# Altium schematic sheet [4]-MECH_BUTTONS.SchDoc: [4]-MECH_BUTTONS
size A3; DocumentNumber: 4; Revision: 01-01-2020; SheetNumber: 4; SheetTotal: 6
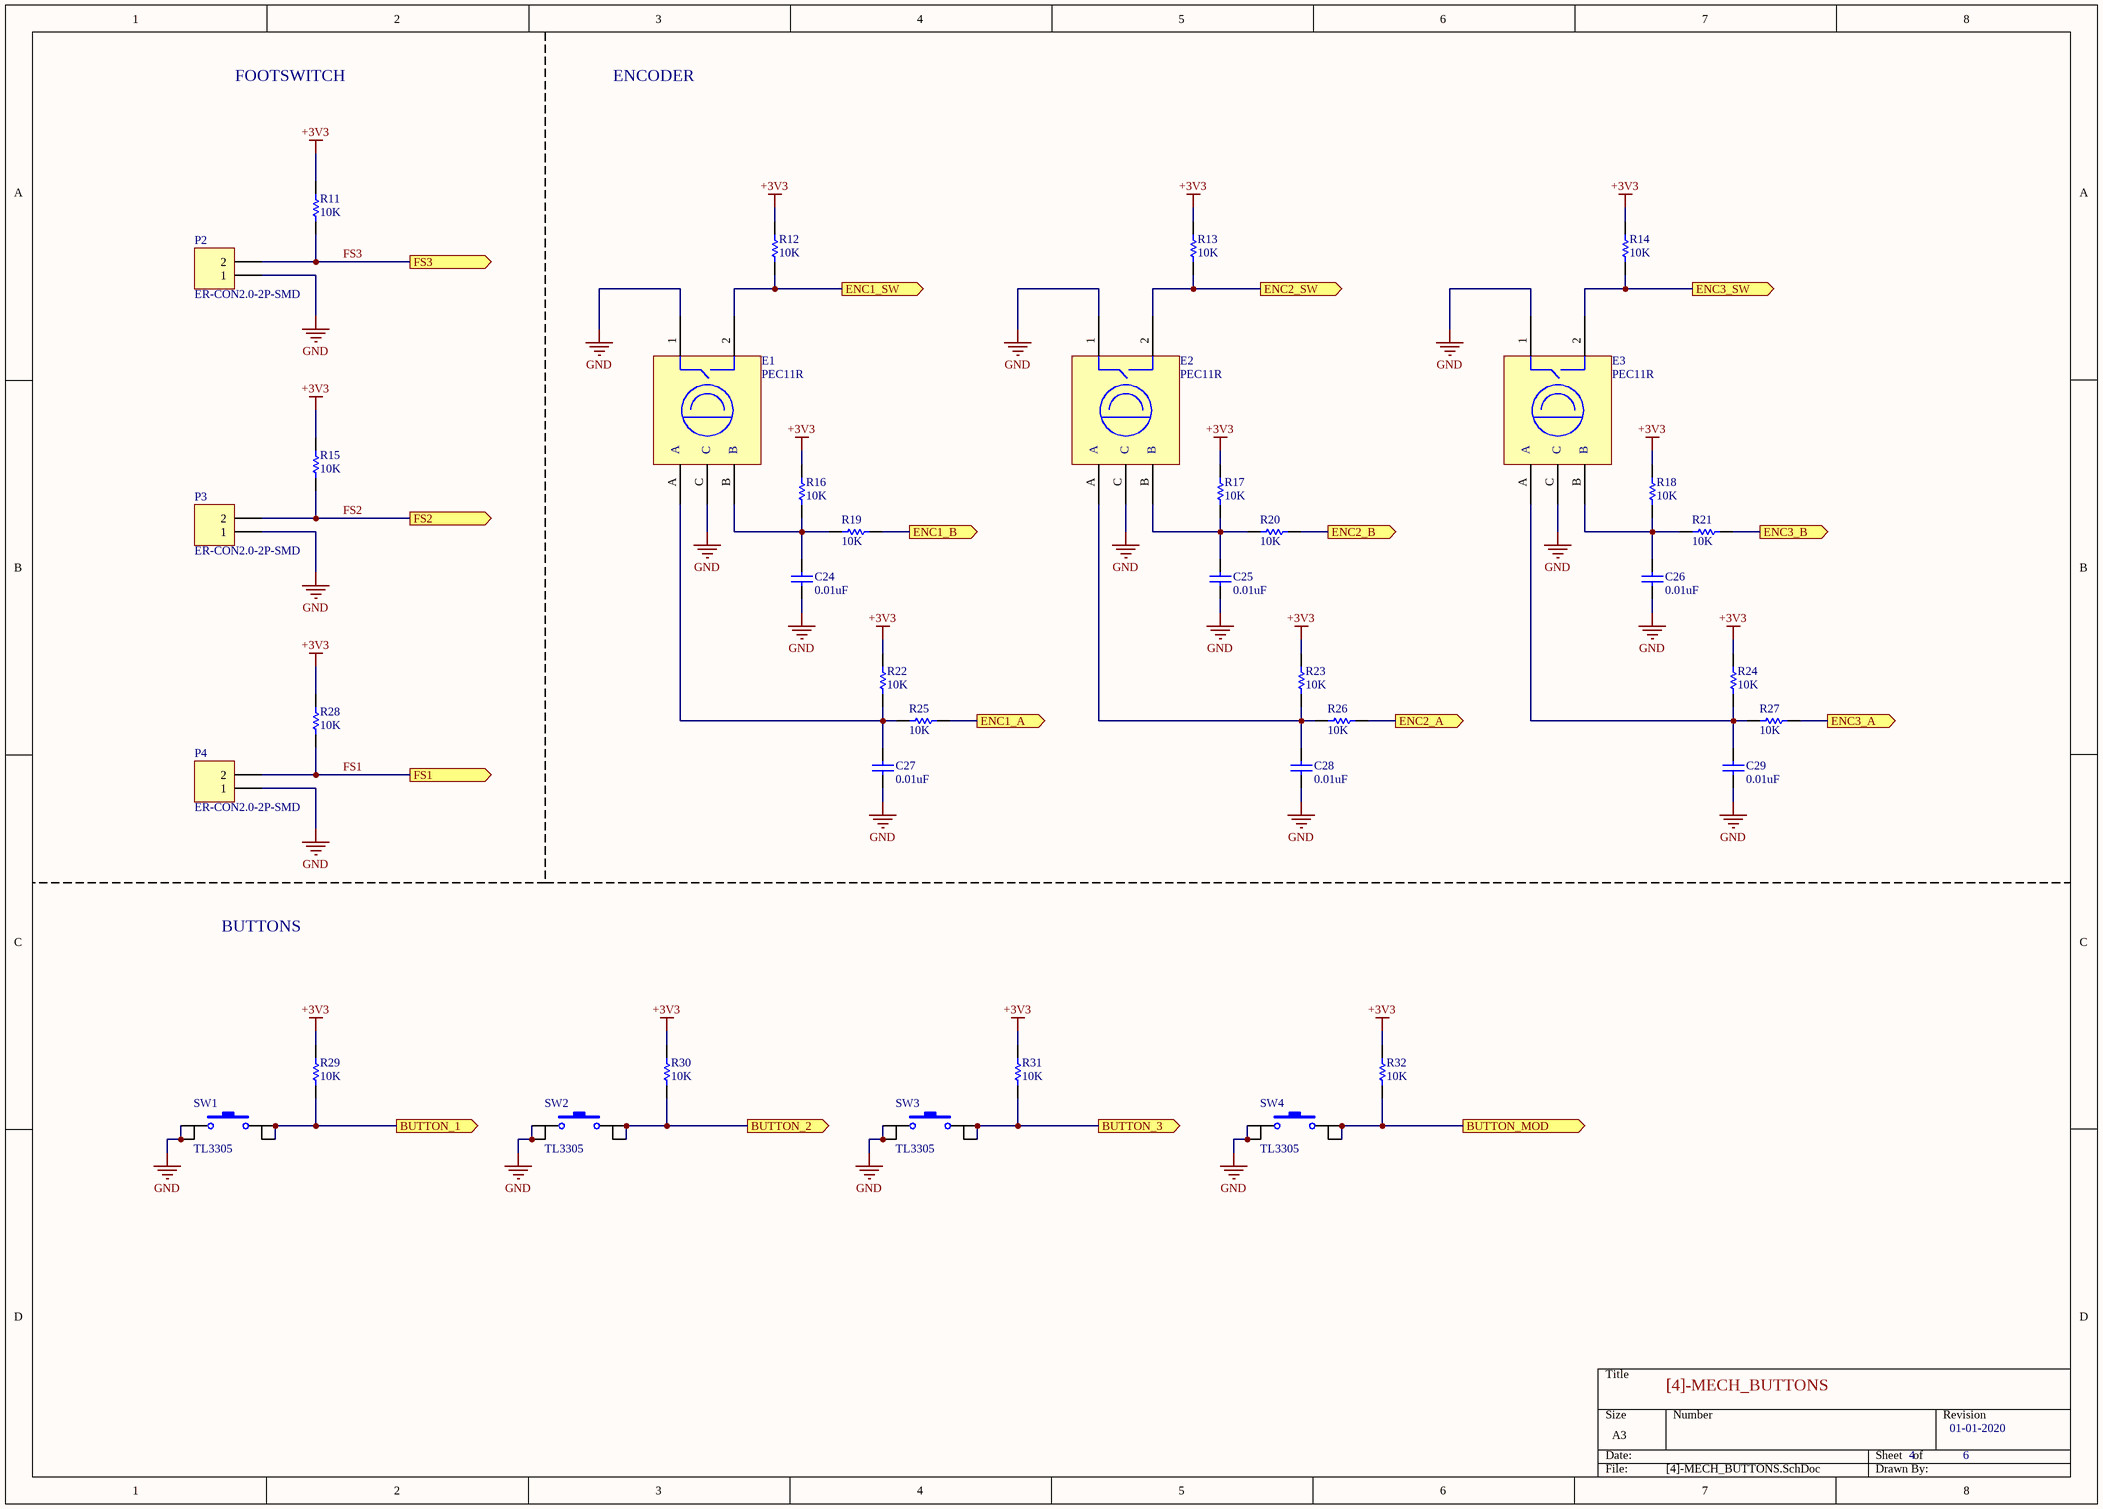
[diagram p0: [4]-MECH_BUTTONS.SchDoc]

## Parts
C24  0.01uF  [CAPC1608N]
C25  0.01uF  [CAPC1608N]
C26  0.01uF  [CAPC1608N]
C27  0.01uF  [CAPC1608N]
C28  0.01uF  [CAPC1608N]
C29  0.01uF  [CAPC1608N]
E1  PEC11R  [PEC11R]
E2  PEC11R  [PEC11R]
E3  PEC11R  [PEC11R]
P2  ER-CON2.0-2P-SMD  [ER-CON2.0-2P-SMD]
P3  ER-CON2.0-2P-SMD  [ER-CON2.0-2P-SMD]
P4  ER-CON2.0-2P-SMD  [ER-CON2.0-2P-SMD]
R11  10K  [RESC1608N]
R12  10K  [RESC1608N]
R13  10K  [RESC1608N]
R14  10K  [RESC1608N]
R15  10K  [RESC1608N]
R16  10K  [RESC1608N]
R17  10K  [RESC1608N]
R18  10K  [RESC1608N]
R19  10K  [RESC1608N]
R20  10K  [RESC1608N]
R21  10K  [RESC1608N]
R22  10K  [RESC1608N]
R23  10K  [RESC1608N]
R24  10K  [RESC1608N]
R25  10K  [RESC1608N]
R26  10K  [RESC1608N]
R27  10K  [RESC1608N]
R28  10K  [RESC1608N]
R29  10K  [RESC1608N]
R30  10K  [RESC1608N]
R31  10K  [RESC1608N]
R32  10K  [RESC1608N]
SW1  TL3305  [TL3305]
SW2  TL3305  [TL3305]
SW3  TL3305  [TL3305]
SW4  TL3305  [TL3305]

## Ports
BUTTON_1 (out), BUTTON_2 (out), BUTTON_3 (out), BUTTON_MOD (out), ENC1_A (out), ENC1_B (out), ENC1_SW (out), ENC2_A (out), ENC2_B (out), ENC2_SW (out), ENC3_A (out), ENC3_B (out), ENC3_SW (out), FS1 (out), FS2 (out), FS3 (out)

## Nets
+3V3: R11.1 R12.2 R13.2 R14.2 R15.1 R16.2 R17.2 R18.2 R22.2 R23.2 R24.2 R28.1 R29.2 R30.2 R31.2 R32.2
GND: C24.1 C25.1 C26.1 C27.1 C28.1 C29.1 E1.1 E1.C E2.1 E2.C E3.1 E3.C P2.1 P3.1 P4.1 SW1.1 SW1.2 SW2.1 SW2.2 SW3.1 SW3.2 SW4.1 SW4.2
BUTTON_1: R29.1 SW1.3 SW1.4 ; port BUTTON_1
BUTTON_2: R30.1 SW2.3 SW2.4 ; port BUTTON_2
BUTTON_3: R31.1 SW3.3 SW3.4 ; port BUTTON_3
BUTTON_MOD: R32.1 SW4.3 SW4.4 ; port BUTTON_MOD
ENC1_A: R25.1 ; port ENC1_A
ENC1_B: R19.1 ; port ENC1_B
ENC1_SW: E1.2 R12.1 ; port ENC1_SW
ENC2_A: R26.1 ; port ENC2_A
ENC2_B: R20.1 ; port ENC2_B
ENC2_SW: E2.2 R13.1 ; port ENC2_SW
ENC3_A: R27.1 ; port ENC3_A
ENC3_B: R21.1 ; port ENC3_B
ENC3_SW: E3.2 R14.1 ; port ENC3_SW
FS1: P4.2 R28.2 ; port FS1
FS2: P3.2 R15.2 ; port FS2
FS3: P2.2 R11.2 ; port FS3
NetC24_2: C24.2 E1.B R16.1 R19.2
NetC25_2: C25.2 E2.B R17.1 R20.2
NetC26_2: C26.2 E3.B R18.1 R21.2
NetC27_2: C27.2 E1.A R22.1 R25.2
NetC28_2: C28.2 E2.A R23.1 R26.2
NetC29_2: C29.2 E3.A R24.1 R27.2

## Notes on the sheet
- FOOTSWITCH
- ENCODER
- BUTTONS

## Library data of the parts
C24-C29 = 06035C-103KAT2A: CAP CER 10000PF 50V X7R 0603; Manufacturer 1: Kyocera AVX; Dielectric Material: Ceramic; Tolerance: 10%; Capacitance: 10nF; Dissipation Factor: 2.5%; Insulation Resistance: 100GR; Supplier 1: Digi-Key; Manufacturer Part Number 1: 06035C-103KAT2A; Stock 1: 40000; Pricing 1: 1=0.1, 10=0.075, 100=0.0334, 500=0.02388, 1000=0.01877 (USD); Mount: Surface Mount,PCB; Case/Package: 0603; Number of Pins: 2; Case Code (Metric): 1608; Case Code (Imperial): 0603; Contact Plating: Tin,Matte; Min Operating Temperature: -55°C; Max Operating Temperature: 125°C; Dielectric: X7R; Voltage Rating (DC): 50V; Packaging: Tape and Reel; Voltage: 50V; Voltage Rating: 50V; Package Quantity: 1; Termination: SMD/SMT; Length: 1.6mm; Height: 0.9mm; Width: 0.032inch; Depth: 0.81mm; Thickness: 0.035inch; Radiation Hardening: No; REACH SVHC: No SVHC; Lead Free: Lead Free; ComponentLink1URL: https://datasheet.ciiva.com/1124/1679506-1124848.pdf; ComponentLink1Description: https://datasheet.ciiva.com/1124/1679506-1124848.pdf; ComponentLink2URL: https://datasheet.ciiva.com/2987/cx7r-2987824.pdf; ComponentLink2Description: https://datasheet.ciiva.com/2987/cx7r-2987824.pdf; ComponentLink3URL: https://datasheet.ciiva.com/150/cx7r-150227.pdf; ComponentLink3Description: https://datasheet.ciiva.com/150/cx7r-150227.pdf; ComponentLink4URL: https://datasheet.ciiva.com/150/cx7r-150228.pdf; ComponentLink4Description: https://datasheet.ciiva.com/150/cx7r-150228.pdf; ComponentLink5URL: https://datasheet.ciiva.com/150/cx7r-150229.pdf; ComponentLink5Description: https://datasheet.ciiva.com/150/cx7r-150229.pdf; ComponentLink6URL: https://datasheet.ciiva.com/16209/cx7r-16209238.pdf; ComponentLink6Description: https://datasheet.ciiva.com/16209/cx7r-16209238.pdf; ComponentLink7URL: https://datasheet.ciiva.com/15212/getdatasheetpartid-87506-15212295.pdf; ComponentLink7Description: https://datasheet.ciiva.com/15212/getdatasheetpartid-87506-15212295.pdf; ComponentLink8URL: https://datasheet.ciiva.com/5423/cx7r-218113-5423178.pdf; ComponentLink8Description: https://datasheet.ciiva.com/5423/cx7r-218113-5423178.pdf; ComponentLink9URL: https://datasheet.ciiva.com/7855/1679506-7855082.pdf; ComponentLink9Description: https://datasheet.ciiva.com/7855/1679506-7855082.pdf; ComponentLink10URL: https://datasheet.ciiva.com/14585/70001075-14585146.pdf; ComponentLink10Description: https://datasheet.ciiva.com/14585/70001075-14585146.pdf; ComponentLink11URL: https://datasheet.ciiva.com/25901/cx7r-25901100.pdf; ComponentLink11Description: https://datasheet.ciiva.com/25901/cx7r-25901100.pdf; ComponentLink12URL: https://datasheet.ciiva.com/1124/1679506-1124847.pdf; ComponentLink12Description: https://datasheet.ciiva.com/1124/1679506-1124847.pdf; ComponentLink13URL: https://datasheet.ciiva.com/2987/cx7r-2987823.pdf; ComponentLink13Description: https://datasheet.ciiva.com/2987/cx7r-2987823.pdf; Supplier Part Number 1: 478-1227-1-ND
E1-E3 = PEC11R-4215F-S0024: ENCODER ROTARY 15MM SHAFT; Manufacturer 1: Bourns; Number of Channels: 2; Encoder Type: Mechanical; Pulses per Revolution: 24; Detent: Yes; Output Type: Quadrature,Incremental; Hole Diameter: 1.8mm; Supplier 1: Digi-Key; Manufacturer Part Number 1: PEC11R-4215F-S0024; Stock 1: 2746; Pricing 1: 1=1.68, 10=1.566, 25=1.4792, 50=1.305, 150=1.073, 300=1.044, 600=0.986, 1050=0.928, 5100=0.812 (USD); Mount: Through Hole,Panel,PCB; Min Operating Temperature: -30°C; Max Operating Temperature: 70°C; Package Quantity: 150; Packaging: Bulk; Termination: PC Pins; Orientation: Vertical; Built in Switch: Yes; Type: Mechanical; Length: 21.5mm; Height: 13.4mm; Width: 12.5mm; Radiation Hardening: No; REACH SVHC: No SVHC; ComponentLink1URL: https://datasheet.ciiva.com/26917/getdatasheetpartid-730131-26917851.pdf; ComponentLink1Description: https://datasheet.ciiva.com/26917/getdatasheetpartid-730131-26917851.pdf; ComponentLink2URL: https://datasheet.ciiva.com/12175/pec11r-221203-12175422.pdf; ComponentLink2Description: https://datasheet.ciiva.com/12175/pec11r-221203-12175422.pdf; Supplier Part Number 1: PEC11R-4215F-S0024-ND
P2-P4 = ER-CON2.0-2P-SMD: CONN 2 POS SMD 2MM PITCH
R11-R32 = AC0603JR-0710KL: RES SMD 10K OHM 5% 1/10W 0603; Manufacturer 1: Yageo; Voltage Rating: 50V; Resistance: 10kR; Power Rating: 100mW; Temperature Coefficient: 100ppm/°C; Supplier 1: Digi-Key; Manufacturer Part Number 1: AC0603JR-0710KL; Stock 1: 60451; Pricing 1: 1=0.1, 10=0.032, 100=0.0131, 1000=0.00588, 2500=0.0051 (USD); Case/Package: 0603; Case Code (Imperial): 0603; Case Code (Metric): 1608; Min Operating Temperature: -55°C; Max Operating Temperature: 155°C; Packaging: Tape and Reel; Tolerance: 5%; Package Quantity: 1; Composition: Thick Film; Termination: SMD/SMT; Number of Terminations: 2; Military Standard: Not; Max Power Dissipation: 100mW; Features: Moisture Resistant,Automotive AEC-Q200,Anti-Sulfur; Length: 0.063inch; Height: 0.022inch; Width: 0.031inch; Depth: 0.8mm; Lead Free: Lead Free; ComponentLink1URL: https://datasheet.ciiva.com/5562/pyu-ac-51-rohs-l-2-5562553.pdf; ComponentLink1Description: https://datasheet.ciiva.com/5562/pyu-ac-51-rohs-l-2-5562553.pdf; Supplier Part Number 1: 311-10KLECT-ND
SW1-SW4 = TL3305AF160QG: SWITCH TACTILE SPST-NO 50MA 12V; Manufacturer 1: E-Switch; Mechanical Life: 500000Cycles; Illumination Type: Non-Illuminated; Operating Force: 160gf; Throw Configuration: SPST; Switch Travel: 0.2mm; Switch Function: Off-Mom; Supplier 1: Digi-Key; Manufacturer Part Number 1: TL3305AF160QG; Stock 1: 67156; Pricing 1: 1=0.22, 10=0.217, 25=0.2096, 50=0.202, 100=0.1907, 250=0.17952, 500=0.17204, 1000=0.1309 (USD); Mount: Surface Mount; Min Operating Temperature: -20°C; Max Operating Temperature: 70°C; Packaging: Tape and Reel; Termination: Gull Wing; Lead Free: Lead Free; Supplier Part Number 1: EG5350CT-ND